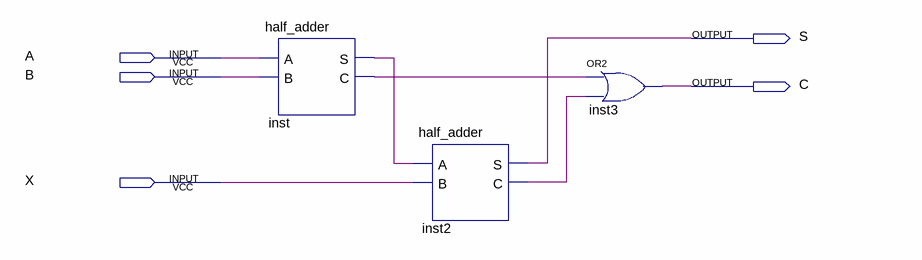
[diagram p0: schematic sheet]
// Quartus schematic full_adder.bdf as structural Verilog: 3 symbols, 5 pins
module full_adder (
  input  A,
  input  B,
  input  X,
  output S,
  output C
);

  wire inst2_c, inst_c, inst_s;

  half_adder inst (.A(A), .B(B), .S(inst_s), .C(inst_c));
  half_adder inst2 (.A(inst_s), .B(X), .S(S), .C(inst2_c));
  or inst3 (C, inst_c, inst2_c);
endmodule
